# Altium schematic sheet F405ADC_plata.SchDoc
size 594 x 420 mm; ApprovedBy: Гришин; CheckedBy: Недвецкий; Author: Буй; Address1: Address1; Address2: Address2; Address3: Address3; Address4: Address4; SheetTotal: 1; Scale: 1:1; Letter1Column: Э
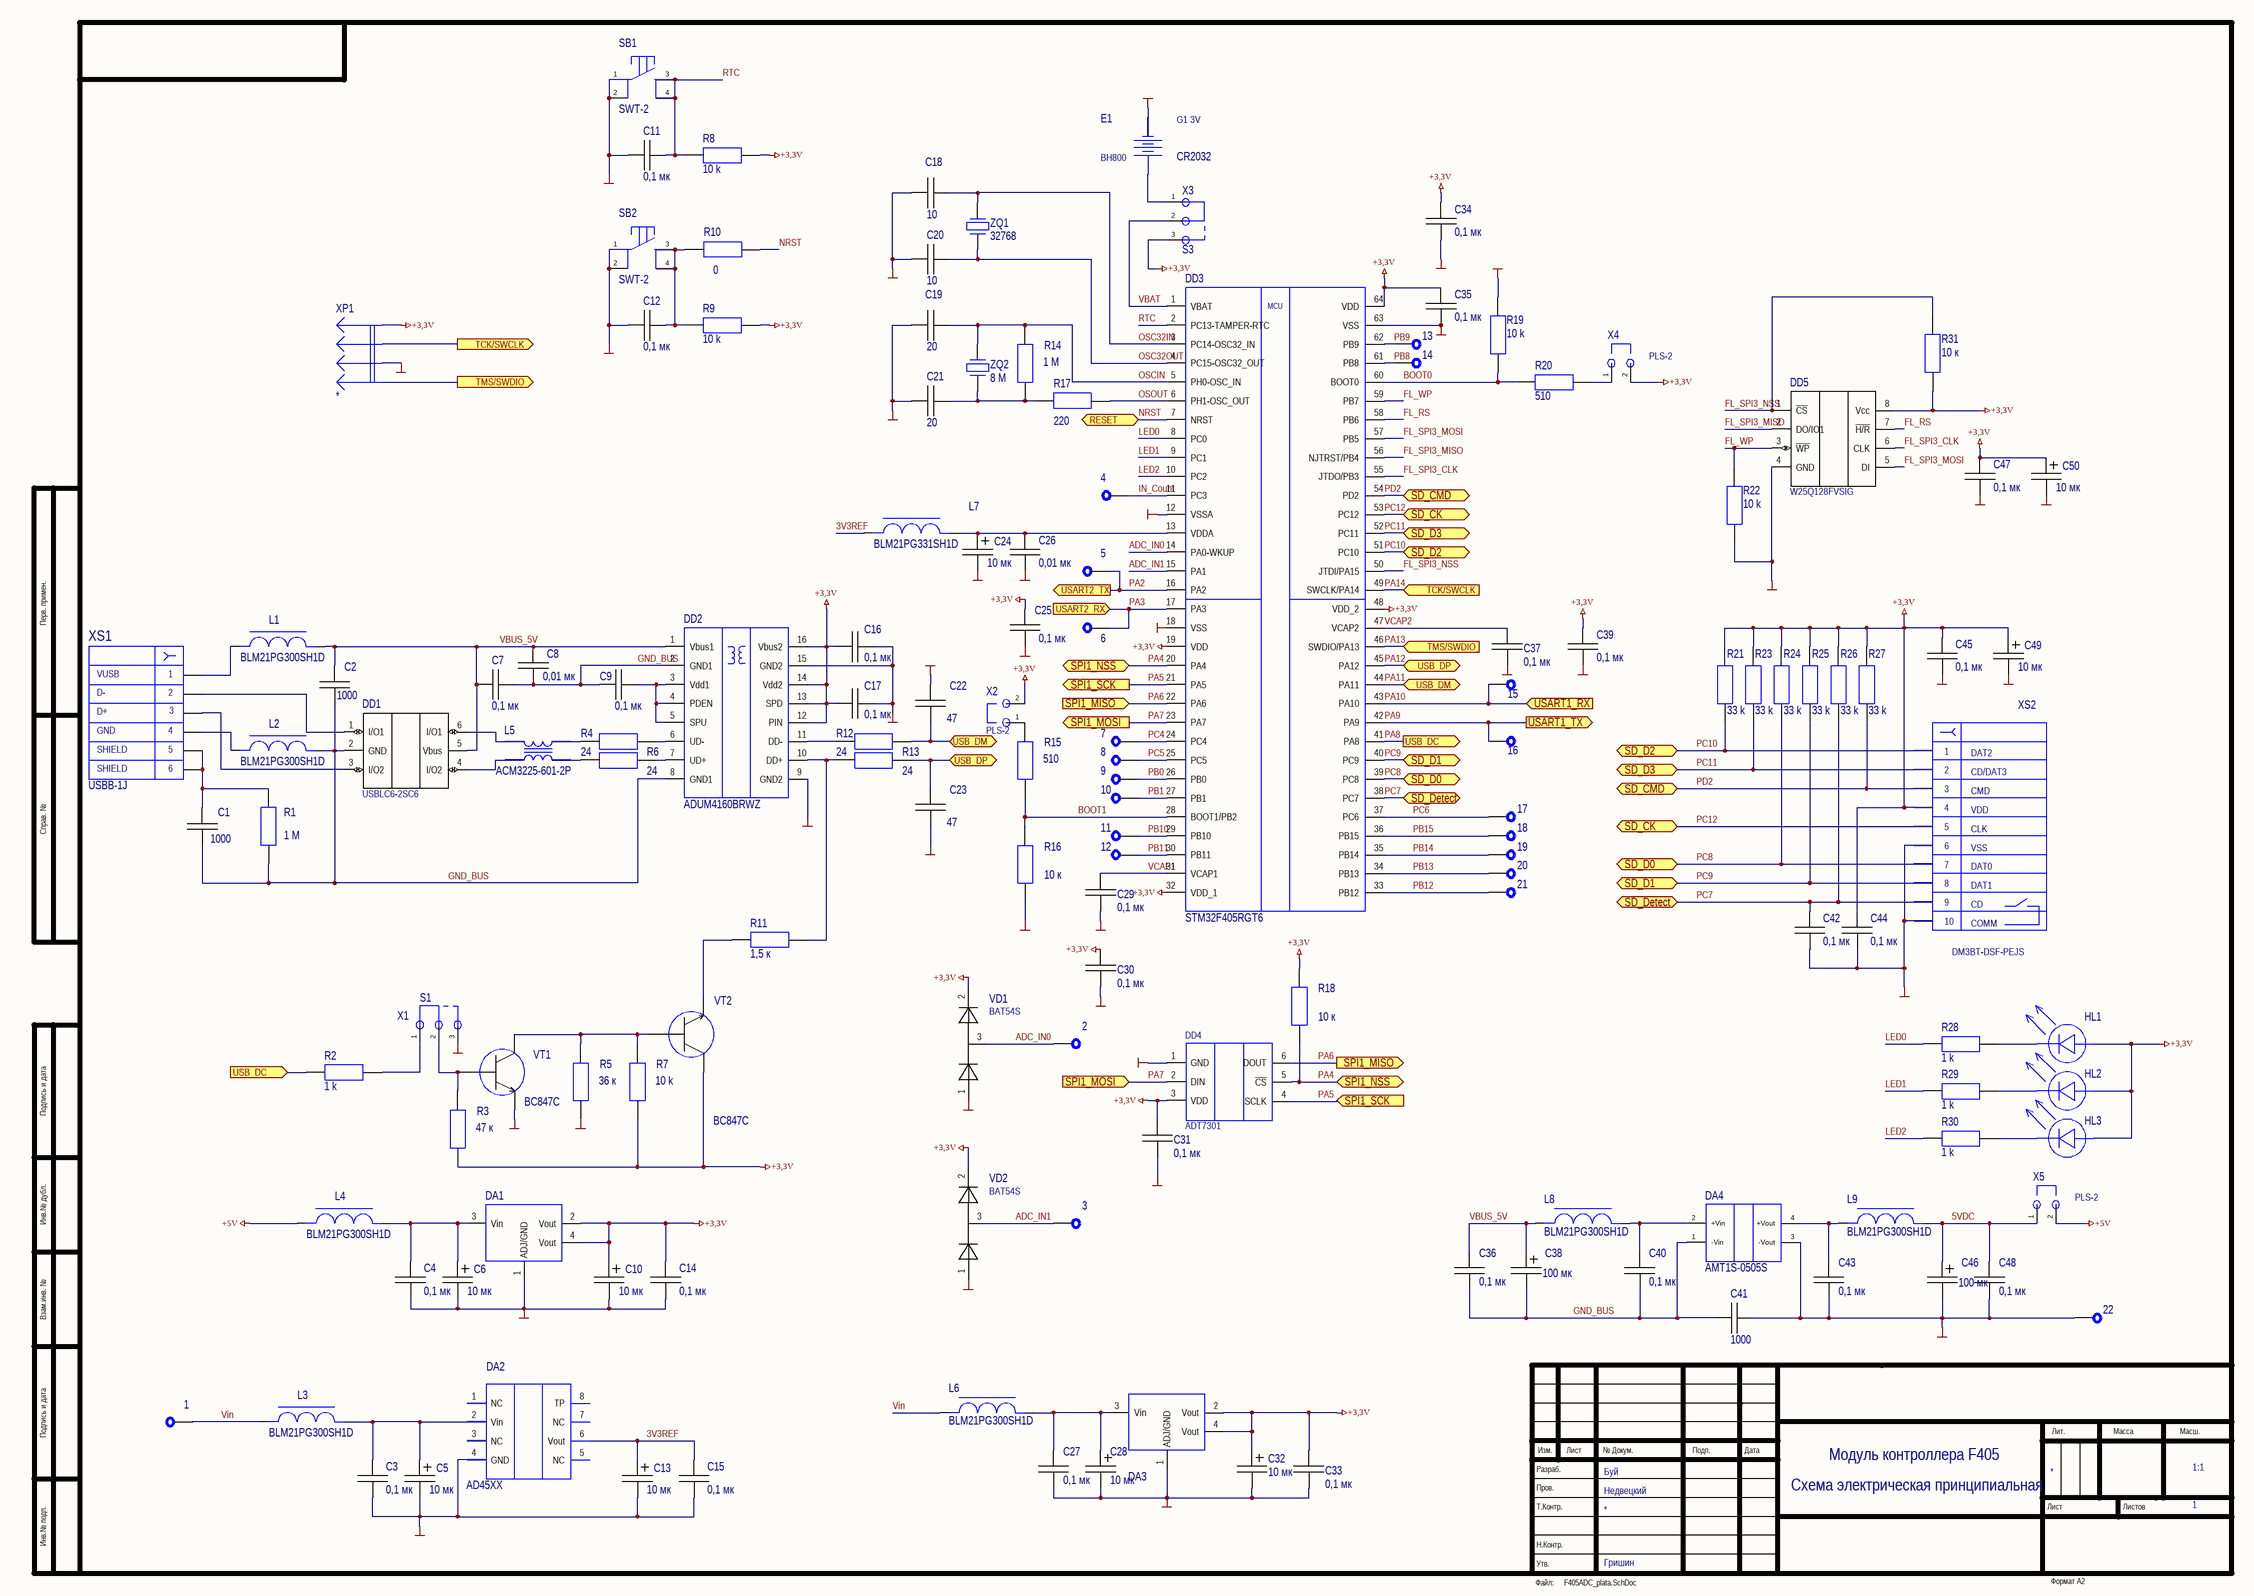
[diagram p0: F405ADC_plata.SchDoc]

## Parts
1  PIN  [Hole]  (value not drawn)
2  PIN  [Hole]  (value not drawn)
3  PIN  [Hole]  (value not drawn)
4  PIN  [Hole]  (value not drawn)
5  PIN  [Hole]  (value not drawn)
6  PIN  [Hole]  (value not drawn)
7  PIN  [Hole]  (value not drawn)
8  PIN  [Hole]  (value not drawn)
9  PIN  [Hole]  (value not drawn)
10  PIN  [Hole]  (value not drawn)
11  PIN  [Hole]  (value not drawn)
12  PIN  [Hole]  (value not drawn)
13  PIN  [Hole]  (value not drawn)
14  PIN  [Hole]  (value not drawn)
15  PIN  [Hole]  (value not drawn)
16  PIN  [Hole]  (value not drawn)
17  PIN  [Hole]  (value not drawn)
18  PIN  [Hole]  (value not drawn)
19  PIN  [Hole]  (value not drawn)
20  PIN  [Hole]  (value not drawn)
21  PIN  [Hole]  (value not drawn)
22  PIN  [Hole]  (value not drawn)
C1  1000  [C0805]
C2  1000  [C0805]
C3  0,1 мк  [C0805]
C4  0,1 мк  [C0805]
C5  10 мк  [3216]
C6  10 мк  [3216]
C7  0,1 мк  [C0805]
C8  0,01 мк  [C0805]
C9  0,1 мк  [C0805]
C10  10 мк  [3216]
C11  0,1 мк  [C0805]
C12  0,1 мк  [C0805]
C13  10 мк  [3216]
C14  0,1 мк  [C0805]
C15  0,1 мк  [C0805]
C16  0,1 мк  [C0805]
C17  0,1 мк  [C0805]
C18  10  [CAPC1608X05N]
C19  20  [CAPC1608X05N]
C20  10  [CAPC1608X05N]
C21  20  [CAPC1608X05N]
C22  47  [C0805]
C23  47  [C0805]
C24  10 мк  [3216]
C25  0,1 мк  [C0805]
C26  0,01 мк  [C0805]
C27  0,1 мк  [C0805]
C28  10 мк  [3216]
C29  0,1 мк  [C0805]
C30  0,1 мк  [C0805]
C31  0,1 мк  [C0805]
C32  10 мк  [3216]
C33  0,1 мк  [C0805]
C34  0,1 мк  [C0805]
C35  0,1 мк  [C0805]
C36  0,1 мк  [C0805]
C37  0,1 мк  [RC0805-2.2]
C38  100 мк  [X-7343-43]
C39  0,1 мк  [C0805]
C40  0,1 мк  [C0805]
C41  1000  [KVR]
C42  0,1 мк  [C0805]
C43  0,1 мк  [C0805]
C44  0,1 мк  [C0805]
C45  0,1 мк  [C0805]
C46  100 мк  [X-7343-43]
C47  0,1 мк  [C0805]
C48  0,1 мк  [C0805]
C49  10 мк  [3216]
C50  10 мк  [3216]
DA1  LM1117  [SOT223]  (value not drawn)
DA2  AD45XX  [SO8]
DA3  LM1117  [SOT223]  (value not drawn)
DA4  AMT1S-0505S  [HOLE_4]
DD1  USBLC6-2SC6  [SOT23-6L]
DD2  ADUM4160BRWZ  [RW-16]
DD3  STM32F405RGT6  [LQFP64_M]
DD4  ADT7301  [SOT23-6]
DD5  W25Q128FVSIG  [SOIC127P790X100-8N]
E1  BH800  value CR2032  G: G1 3V  [BATTERY_20mm]
HL1  REC-T1608UYC-B1-6  [C0805]  (value not drawn)
HL2  REC-T1608UYC-B1-6  [C0805]  (value not drawn)
HL3  REC-T1608UYC-B1-6  [C0805]  (value not drawn)
L1  BLM21PG300SH1D  [C0805]
L2  BLM21PG300SH1D  [C0805]
L3  BLM21PG300SH1D  [C0805]
L4  BLM21PG300SH1D  [C0805]
L5  ACM3225-601-2P  [ACM3225]
L6  BLM21PG300SH1D  [C0805]
L7  BLM21PG331SH1D  [C0805]
L8  BLM21PG300SH1D  [C0805]
L9  BLM21PG300SH1D  [C0805]
R1  1 M  [RC0805-2]
R2  1 k  [RC0805-2]
R3  47 к  [RC0805-2]
R4  24  [RC0805-2]
R5  36 к  [RC0805-2]
R6  24  [RC0805-2]
R7  10 k  [RC0805-2]
R8  10 k  [RC0805-2]
R9  10 k  [RC0805-2]
R10  0  [RC0805-2]
R11  1,5 к  [RC0805-2]
R12  24  [RC0805-2]
R13  24  [RC0805-2]
R14  1 М  [CAPC1608X05N]
R15  510  [RC0805-2]
R16  10 к  [RC0805-2]
R17  220  [CAPC1608X05N]
R18  10 к  [RC0805-2]
R19  10 k  [RC0805-2.2]
R20  510  [RC0805-2.2]
R21  33 k  [RC0805-2]
R22  10 k  [RC0805-2]
R23  33 k  [RC0805-2]
R24  33 k  [RC0805-2]
R25  33 k  [RC0805-2]
R26  33 k  [RC0805-2]
R27  33 k  [RC0805-2]
R28  1 k  [RC0805-2]
R29  1 k  [RC0805-2]
R30  1 k  [RC0805-2]
R31  10 к  [RC0805-2]
SB1  SWT-2  [SWT2]
SB2  SWT-2  [SWT2]
VD1  BAT54S  [SOT23]
VD2  BAT54S  [SOT23]
VT1  BC847C  [SOT23]
VT2  BC847C  [SOT23]
X1  Jamper: S1  [PLS-3]  (hidden comment: PLS-03)
X2  PLS-2  [PLS-2]
X3  Jamper: S3  [PLS-3]  (hidden comment: PLS-03)
X4  PLS-2  [PLS-2]
X5  PLS-2  [PLS-2]
XP1  *  [PLS-4]
XS1  USBB-1J  [USBB-1J]
XS2  DM3BT-DSF-PEJS  [112J-TDAR-R]
ZQ1  32768  [KX–327NHT]
ZQ2  8 М  [HC-49U_5mm]

## Ports
RESET (bidir), SD_CK (bidir), SD_CMD (bidir), SD_D0 (bidir), SD_D1 (bidir), SD_D2 (bidir), SD_D3 (bidir), SD_Detect (bidir), SPI1_MISO (in), SPI1_MISO (out), SPI1_MOSI (in), SPI1_MOSI (out), SPI1_NSS (bidir), SPI1_SCK (in), SPI1_SCK (out), TCK/SWCLK (in), TCK/SWCLK (out), TMS/SWDIO (in), TMS/SWDIO (out), USART1_RX (in), USART1_TX (out), USART2_RX (in), USART2_TX (out), USB_DC (in), USB_DC (out), USB_DM (bidir), USB_DP (bidir)

## Nets
+3,3V: C10.1(+) C14.1 C16.1 C17.1 C25.1 C30.1 C31.1 C32.1(+) C33.1 C34.1 C35.1 C39.1 C44.1 C45.1 C47.1 C49.1(+) C50.1(+) DA1.2(Vout) DA1.4(Vout) DA3.2(Vout) DA3.4(Vout) DD2.12(PIN) DD2.13(SPD) DD2.14(Vdd2) DD2.16(Vbus2) DD3.19(VDD) DD3.32(VDD_1) DD3.48(VDD_2) DD3.64(VDD) DD4.3(VDD) DD5.8(Vcc) HL1.1(+) HL2.1(+) HL3.1(+) R3.2 R7.2 R8.2 R9.2 R18.1 R21.1 R23.1 R24.1 R25.1 R26.1 R27.1 R31.1 VD1.2(-) VD2.2(-) VT2.3(K) X2.2 X3.3 X4.2 XP1.1 XS2.4
+5V: L4.1 X5.2
GND: 22.1 C3.2 C4.2 C5.2(-) C6.2(-) C10.2(-) C11.1 C12.1 C13.2(-) C14.2 C15.2 C16.2 C17.2 C18.1 C19.1 C20.1 C21.1 C22.1 C23.2 C24.2(-) C25.2 C26.2 C27.2 C28.2(-) C29.2 C30.2 C31.2 C32.2(-) C33.2 C34.2 C35.2 C37.2 C39.2 C41.2 C42.2 C43.2 C44.2 C45.2 C46.2 C47.2 C48.2 C49.2(-) C50.2(-) DA1.1(ADJ/GND) DA2.4(GND) DA3.1(ADJ/GND) DA4.3(-Vout) DD2.9(GND2) DD2.15(GND2) DD3.12(VSSA) DD3.18(VSS) DD3.63(VSS) DD4.1(GND) DD5.4(GND) E1.2 R5.2 R16.2 R19.1 R22.2 SB1.1 SB1.2 SB2.1 SB2.2 VD1.1(+) VD2.1(+) VT1.2(E) X1.3 XP1.3 XS2.6 XS2.10
3V3REF: C13.1(+) C15.1 DA2.6(Vout) L7.1
5VDC: C46.1 C48.1 L9.2 X5.1
ADC_IN0: 2.1 DD3.14(PA0-WKUP) VD1.3
ADC_IN1: 3.1 DD3.15(PA1) VD2.3
BOOT0: DD3.60(BOOT0) R19.2 R20.1
BOOT1: DD3.28(BOOT1/PB2) R15.2 R16.1
FL_RS: DD3.58(PB6) DD5.7(~{H/R})
FL_SPI3_CLK: DD3.55(JTDO/PB3) DD5.6(CLK)
FL_SPI3_MISO: DD3.56(NJTRST/PB4) DD5.2(DO/IO1)
FL_SPI3_MOSI: DD3.57(PB5) DD5.5(DI)
FL_SPI3_NSS: DD3.50(JTDI/PA15) DD5.1(~{CS}) R31.2
FL_WP: DD3.59(PB7) DD5.3(~{WP}) R22.1
GND_BUS: C1.1 C2.1 C7.2 C8.2 C9.1 C36.2 C38.2 C40.2 C41.1 DA4.1(-Vin) DD1.2(GND) DD2.2(GND1) DD2.8(GND1) L2.2 R1.1
IN_Count: 4.1 DD3.11(PC3)
LED0: DD3.8(PC0) R28.1
LED1: DD3.9(PC1) R29.1
LED2: DD3.10(PC2) R30.1
NRST: DD3.7(NRST) R10.1 ; port RESET
OSC32IN: C18.2 DD3.3(PC14-OSC32_IN) ZQ1.1
OSC32OUT: C20.2 DD3.4(PC15-OSC32_OUT) ZQ1.2
OSCIN: C19.2 DD3.5(PH0-OSC_IN) R14.1 ZQ2.2
OSOUT: DD3.6(PH1-OSC_OUT) R17.1
PA2: 5.1 DD3.16(PA2) ; port USART2_TX
PA3: 6.1 DD3.17(PA3) ; port USART2_RX
PA4: DD3.20(PA4) DD4.5(~{CS}) R18.2 ; port SPI1_NSS
PA5: DD3.21(PA5) DD4.4(SCLK) ; port SPI1_SCK
PA6: DD3.22(PA6) DD4.6(DOUT) ; port SPI1_MISO
PA7: DD3.23(PA7) DD4.2(DIN) ; port SPI1_MOSI
PA8: DD3.41(PA8) R2.1 ; port USB_DC
PA9: 16.1 DD3.42(PA9) ; port USART1_TX
PA10: 15.1 DD3.43(PA10) ; port USART1_RX
PA11: C22.2 DD3.44(PA11) R12.2 ; port USB_DM
PA12: C23.1 DD3.45(PA12) R13.2 ; port USB_DP
PA13: DD3.46(SWDIO/PA13) XP1.4 ; port TMS/SWDIO
PA14: DD3.49(SWCLK/PA14) XP1.2 ; port TCK/SWCLK
PB0: 9.1 DD3.26(PB0)
PB1: 10.1 DD3.27(PB1)
PB8: 14.1 DD3.61(PB8)
PB9: 13.1 DD3.62(PB9)
PB10: 11.1 DD3.29(PB10)
PB11: 12.1 DD3.30(PB11)
PB12: 21.1 DD3.33(PB12)
PB13: 20.1 DD3.34(PB13)
PB14: 19.1 DD3.35(PB14)
PB15: 18.1 DD3.36(PB15)
PC4: 7.1 DD3.24(PC4)
PC5: 8.1 DD3.25(PC5)
PC6: 17.1 DD3.37(PC6)
PC7: C42.1 DD3.38(PC7) R26.2 XS2.9 ; port SD_Detect
PC8: DD3.39(PC8) R24.2 XS2.7 ; port SD_D0
PC9: DD3.40(PC9) R25.2 XS2.8 ; port SD_D1
PC10: DD3.51(PC10) R21.2 XS2.1 ; port SD_D2
PC11: DD3.52(PC11) R23.2 XS2.2 ; port SD_D3
PC12: DD3.53(PC12) XS2.5 ; port SD_CK
PD2: DD3.54(PD2) R27.2 XS2.3 ; port SD_CMD
RTC: C11.2 DD3.2(PC13-TAMPER-RTC) R8.1 SB1.3 SB1.4
VBAT: DD3.1(VBAT) X3.2
VBUS_5V: C2.2 C7.1 C8.1 C36.1 C38.1 DD1.5(Vbus) DD2.1(Vbus1) L1.2 L8.1
VCAP1: C29.1 DD3.31(VCAP1)
VCAP2: C37.1 DD3.47(VCAP2)
Vin: 1.1 L3.1 L6.1
NetC1_2: C1.2 R1.2 XS1.5 XS1.6
NetC3_1: C3.1 C5.1(+) DA2.2(Vin) L3.2
NetC4_1: C4.1 C6.1(+) DA1.3(Vin) L4.2
NetC9_2: C9.2 DD2.3(Vdd1) DD2.4(PDEN) DD2.5(SPU)
NetC12_2: C12.2 R9.1 R10.2 SB2.3 SB2.4
NetC21_2: C21.2 R14.2 R17.2 ZQ2.1
NetC24_1: C24.1(+) C26.1 DD3.13(VDDA) L7.2
NetC27_1: C27.1 C28.1(+) DA3.3(Vin) L6.2
NetC40_1: C40.1 DA4.2(+Vin) L8.2
NetC43_1: C43.1 DA4.4(+Vout) L9.1
NetDD1_1: DD1.1(I/O1) XS1.2
NetDD1_3: DD1.3(I/O2) XS1.3
NetDD1_4: DD1.4(I/O2) L5.2
NetDD1_6: DD1.6(I/O1) L5.1
NetDD2_6: DD2.6(UD-) R4.2
NetDD2_7: DD2.7(UD+) R6.2
NetDD2_10: DD2.10(DD+) R11.1 R13.1
NetDD2_11: DD2.11(DD-) R12.1
NetE1_1: E1.1 X3.1
NetHL1_2: HL1.2(-) R28.2
NetHL2_2: HL2.2(-) R29.2
NetHL3_2: HL3.2(-) R30.2
NetL1_1: L1.1 XS1.1
NetL2_1: L2.1 XS1.4
NetL5_3: L5.3 R6.1
NetL5_4: L5.4 R4.1
NetR2_2: R2.2 X1.1
NetR3_1: R3.1 VT1.1(B) X1.2
NetR5_1: R5.1 R7.1 VT1.3(K) VT2.1(B)
NetR11_2: R11.2 VT2.2(E)
NetR15_1: R15.1 X2.1
NetR20_2: R20.2 X4.1

Not connected (* = marked no-connect by the designer): DA2 1(NC) 3(NC) 5(NC) 7(NC) 8(TP)

## Notes on the sheet
- VUSB
- D-
- D+
- GND
- SHIELD
- Модуль контроллера F405
- Схема электрическая принципиальная
- Перв. примен.
- Справ. №
- Подпись и дата
- Инв.№ дубл.
- Взам.инв. №
- Разраб.
- Изм.
- Лист
- № Докум.
- Подп.
- Дата
- Лит.
- Масса
- Масш.
- Пров.
- Т.Контр.
- Листов
- Инв.№ подп.
- Утв.
- Н.Контр.
- Файл:
- Формат А2
- (in symbol MicroSD) DAT2; CD/DAT3; CMD; VDD; CLK; VSS; DAT0; DAT1; CD; COMM
- (in symbol STM32F405RGT6) MCU

## Library data of the parts
1-22 = PIN: PIN, hole
C1-C4 C7-C9 C11 C12 C14-C23 C25-C27 C29-C31 C33-C37 C39-C45 C47 C48 = C: Capasitor
  C1: ValueSCH: 1000; MarkPCB: *; Name: *; Part Number: C; Component Kind: Standard; Component Type: Standard; Designator: C; Footprint: K73-17; Pin Count: 2
  C2: ValueSCH: 1000; MarkPCB: *; Name: *
  C3 C4 C7 C9 C14-C17 C25 C27 C29-C31 C33-C37 C39 C40 C42-C45 C47 C48: ValueSCH: 0,1 мк; MarkPCB: *; Name: *; Part Number: C; Component Kind: Standard; Component Type: Standard; Designator: C; Footprint: K73-17; Pin Count: 2
  C8 C26: ValueSCH: 0,01 мк; MarkPCB: *; Name: *; Part Number: C; Component Kind: Standard; Component Type: Standard; Designator: C; Footprint: K73-17; Pin Count: 2
  C11 C12: ValueSCH: 0,1 мк; MarkPCB: *; Name: *
  C18 C20: ValueSCH: 10; MarkPCB: *; Name: *
  C19 C21: ValueSCH: 20; MarkPCB: *; Name: *
  C22 C23: ValueSCH: 47; MarkPCB: *; Name: *; Part Number: C; Component Kind: Standard; Component Type: Standard; Designator: C; Footprint: K73-17; Pin Count: 2
  C41: Value: 1000; ComponentLink1URL: *; ManufacturerPartNumber: *; Supplier Part Number 1: *; ComponentLink1Description: Параметры; Manufacturer: *; Power\Voltage: *; Tolerance: *; ComponentLink2URL: *; TU/GOST: *; Корпус: *; Примечание: *; ComponentLink2Description: Сайт протзводителя; ValueSCH: *
C5 C6 C10 C13 C24 C28 C32 C38 C46 C49 C50 = CapPol: Capasitor_polar
  C5 C6 C10 C13 C24 C28 C32 C49 C50: ValueSCH: 10 мк; Part Number: CapPol; Component Kind: Standard; Component Type: Standard; Designator: CapPol; Footprint: CapPolar; Pin Count: 2
  C38 C46: Value: 100 мк; ComponentLink1URL: *; ManufacturerPartNumber: *; Supplier Part Number 1: *; ComponentLink1Description: Параметры; Manufacturer: *; Power\Voltage: *; Tolerance: *; ComponentLink2URL: *; TU/GOST: *; Корпус: *; Примечание: *; ComponentLink2Description: Сайт протзводителя; ValueSCH: *
DA1 DA3 = LM1117: Positive voltage regulators; Manufacturer: National Semiconductor; Корпус: SOT-223; ComponentLink1Description: Параметры; ComponentLink2Description: Сайт производителя; ComponentLink2URL: *; ManufacturerPartNumber: LM1117; Power\Voltage: *; Rem: *; TKE: *; Tolerance: *; TU/GOST: *; Value: *; Примечание: *; Mark: *
DA2 = AD45XX: Ultralow Noise, High Accuracy  Voltage References; Manufacturer: Analog Devices; Value: *; ComponentLink1URL: D:\datasheet\REF\ADR4520_4525_4530_4533_4540_4550.pdf; ManufacturerPartNumber: AD45XX
DD1 = USBLC6: ESD PROTECTION; Manufacturer: STMicroelectronics; ComponentLink1Description: Параметры; ComponentLink2Description: Сайт производителя; ComponentLink1URL: D:\datasheet\USBLC6-2SC6.pdf; ComponentLink2URL: *; ManufacturerPartNumber: USBLC6-2SC6; Power\Voltage: *; Rem: *; TKE: *; Tolerance: *; TU/GOST: *; Value: *; Примечание: *
DD2 = ADUM4160: ManufacturerPartNumber: ADUM4160BRWZ
DD4 = ADT7301: Temperature sensor; Value: ADT7301
DD5 = W25Q128FVSIG: Flash; ComponentLink1Description: Параметры; ComponentLink2Description: Сайт производителя; ManufacturerPartNumber: W25Q128FVSIG; Power\Voltage: *; Rem: *; TKE: *; Tolerance: *; TU/GOST: *; Value: *; Примечание: *
E1 = BH800: Firma: OEM; Mark: BH800
HL1-HL3 = HLSMD: HL; Value: REC-T1608UYC-B1-6
L1-L4 L6-L9 = B: Ferrite bead; datasheet: *
  L1-L4 L6 L8 L9: Value: BLM21PG300SH1D
  L7: Value: BLM21PG331SH1D
R1-R31 = R_Gost: Resistor,2 Pin; ValueBOM: *; MarkPCB: *
  R1: ValueSCH: 1 M
  R2 R28-R30: ValueSCH: 1 k
  R3: ValueSCH: 47 к
  R4 R6 R12 R13: ValueSCH: 24
  R5: ValueSCH: 36 к
  R7-R9 R19 R22: ValueSCH: 10 k
  R10: ValueSCH: 0
  R11: ValueSCH: 1,5 к
  R14: ValueSCH: 1 М
  R15 R20: ValueSCH: 510
  R16 R18 R31: ValueSCH: 10 к
  R17: ValueSCH: 220
  R21 R23-R27: ValueSCH: 33 k
SB1 SB2 = SWT-2: SWT-2, key; Value: SWT-2
VD1 VD2 = BS40-04: Diod Schottky, 3 pin; Manufacturer: Fairchild; Mark: BS40-04; ComponentLink1Description: Параметры; ComponentLink2Description: Сайт производителя; ComponentLink1URL: D\datasheet\BAT54.pdf; ComponentLink2URL: *; ManufacturerPartNumber: BAT54S; Power\Voltage: *; Rem: *; TKE: *; Tolerance: *; TU/GOST: *; Value: *; Примечание: *
VT1 VT2 = BC846: Transistor NPN Generic; Value: *; ComponentLink1URL: *; ManufacturerPartNumber: BC847C; Supplier Part Number 1: *; ComponentLink1Description: Параметры; Manufacturer: *; Power\Voltage: *; Tolerance: *; ComponentLink2URL: *; TU/GOST: *; Корпус: *; Примечание: *; ComponentLink2Description: Сайт протзводителя; ValueSCH: *; Mark: *
X1 X3 = J3: Value: PLS-03
X2 X4 X5 = J2: PLS-02; Manufacturer: Ningbo; Jamper: S; ComponentLink1Description: Параметры; ComponentLink2Description: Сайт производителя; ComponentLink2URL: *; ManufacturerPartNumber: PLS-2; Power\Voltage: *; Rem: *; TKE: *; Tolerance: *; TU/GOST: *; Value: *; Примечание: *
XP1 = XP4: Value: *
XS1 = USBB-1J: Firma1: YAMAICHI; Value: USBB-1J
XS2 = MicroSD: SD-card socket; Manufacturer: Hirose; ManufacturerPartNumber1: DM3AT-SF-PEJM5; ManufacturerPartNumber: DM3BT-DSF-PEJS; ComponentLink1Description: Параметры; ComponentLink2Description: Сайт производителя; ComponentLink1URL: D:\datasheet\SD-card\DM3AT-SF.pdf; ComponentLink2URL: *; Power\Voltage: *; Rem: *; TKE: *; Tolerance: *; TU/GOST: *; Value: *; Примечание: *
ZQ1 ZQ2 = OSC: ManufacturerPartNumber: *; ComponentLink1URL: D:\datasheet\Кварцы\00688.pdf; Manufacturer: *
  ZQ1: Value: 32768
  ZQ2: Value: 8 М
DA4 = AMT1S-0505S: Value: *
DD3 = STM32F405RGT6: ManufacturerPartNumber: STM32F405RGT6
L5 = ACM3225-601-2P: ManufacturerPartNumber: ACM3225-601-2P